# Altium schematic sheet Alimentazione.SchDoc: Alimentazione sveglia
size A4; Author: Cavallo Gabriele; DrawnBy: Cavallo Gabriele
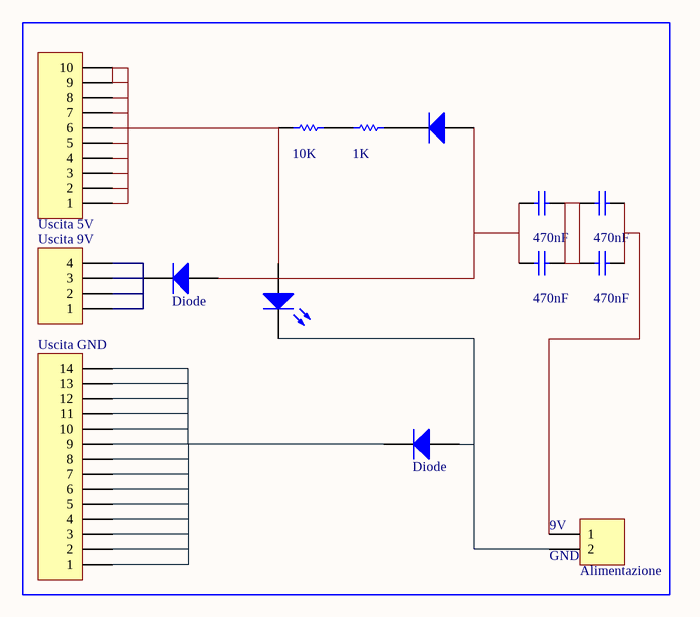
[diagram p0: Alimentazione.SchDoc]

## Parts
(Parts that share a designator on the sheet are numbered #1, #2 ... from top to bottom, then left to right.)
?#1  value 10K  [AXIAL-0.5]  (hidden comment: Res Semi)
?#2  value 1K  [AXIAL-0.5]  (hidden comment: Res Semi)
?#3  Diode 1N914  [DO-35]  (value not drawn)
?#4  value 470nF  [RAD-0.3]  (hidden comment: Cap)
?#5  Uscita 5V  [HDR1X10]
?#6  Diode  [DO-35]
?#7  LED0  [LED-0]  (value not drawn)
?#8  Diode  [DO-35]
?#9  Alimentazione  [HDR1X2]
?#10  Uscita GND  [HDR1X14]
C?#1  value 470nF  [RAD-0.3]  (hidden comment: Cap)
C?#2  value 470nF  [RAD-0.3]  (hidden comment: Cap)
C?#3  value 470nF  [RAD-0.3]  (hidden comment: Cap)
P?  Uscita 9V  [HDR1X4]

## Nets
Net?#1_2: ?#1.2 ?#2.1
Net?#2_2: ?#2.2 ?#3.2(K)

Not connected (* = marked no-connect by the designer): ?#1 1; ?#3 1(A); ?#4 1 2; ?#5 1 2 3 4 5 6 7 8 9 10; ?#6 1(A) 2(K); ?#7 1(A) 2(K); ?#8 1(A) 2(K); ?#9 1 2; ?#10 1 2 3 4 5 6 7 8 9 10 11 12 13 14; C?#1 1 2; C?#2 1 2; C?#3 1 2; P? 1 2 3 4

## Notes on the sheet
- 9V
- GND

## Library data of the parts
?#1 ?#2 = Res Semi: Semiconductor Resistor; Published: 8-Jun-2000; LatestRevisionDate: 17-Jul-2002; LatestRevisionNote: Re-released for DXP Platform.; PackageReference: AXIAL-0.5; Publisher: Altium Limited
?#3 ?#6 ?#8 = Diode 1N914: High Conductance Fast Diode; Published: 8-Jun-2000; LatestRevisionDate: 17-Jul-2002; LatestRevisionNote: Re-released for DXP Platform.; DatasheetDocument: 1997; PackageReference: DO-35; Publisher: Altium Limited; Code_JEDEC: DO-204-AH; ComponentLink1Description: Manufacturer Link; ComponentLink1URL: http://www.fairchildsemi.com/; ComponentLink2Description: Datasheet; ComponentLink2URL: http://www.fairchildsemi.com/ds/1N%2F1N4448.pdf
?#4 C?#1-C?#3 = Cap: Capacitor; Published: 8-Jun-2000; LatestRevisionDate: 17-Jul-2002; LatestRevisionNote: Re-released for DXP Platform.; PackageReference: RAD-0.3; Publisher: Altium Limited
?#5 = Header 10: Header, 10-Pin; LatestRevisionDate: 17-Jul-2002; LatestRevisionNote: Re-released for DXP Platform.; Publisher: Altium Limited
?#7 = LED0: Typical INFRARED GaAs LED; Published: 8-Jun-2000; LatestRevisionDate: 08-Jul-2005; LatestRevisionNote: Mech Layer 1 removed.; PackageReference: LED-0; Publisher: Altium Limited
?#9 = Header 2: Header, 2-Pin; LatestRevisionDate: 17-Jul-2002; LatestRevisionNote: Re-released for DXP Platform.; Publisher: Altium Limited
?#10 = Header 14: Header, 14-Pin; LatestRevisionDate: 17-Jul-2002; LatestRevisionNote: Re-released for DXP Platform.; Publisher: Altium Limited
P? = Header 4: Header, 4-Pin; LatestRevisionDate: 17-Jul-2002; LatestRevisionNote: Re-released for DXP Platform.; Publisher: Altium Limited